# Altium schematic sheet LOGIC_FPGA.SchDoc: FPGA Logic
size B; Author: Michael Jones; Engineer: Michael Jones; Organization: Group VIII Technology; Address1: 1652 W 820 N; Address2: Provo; Address3: UT  84601; Address4: 801-379-0118; DocumentNumber: 3; Revision: A3; SheetNumber: 2; SheetTotal: 7
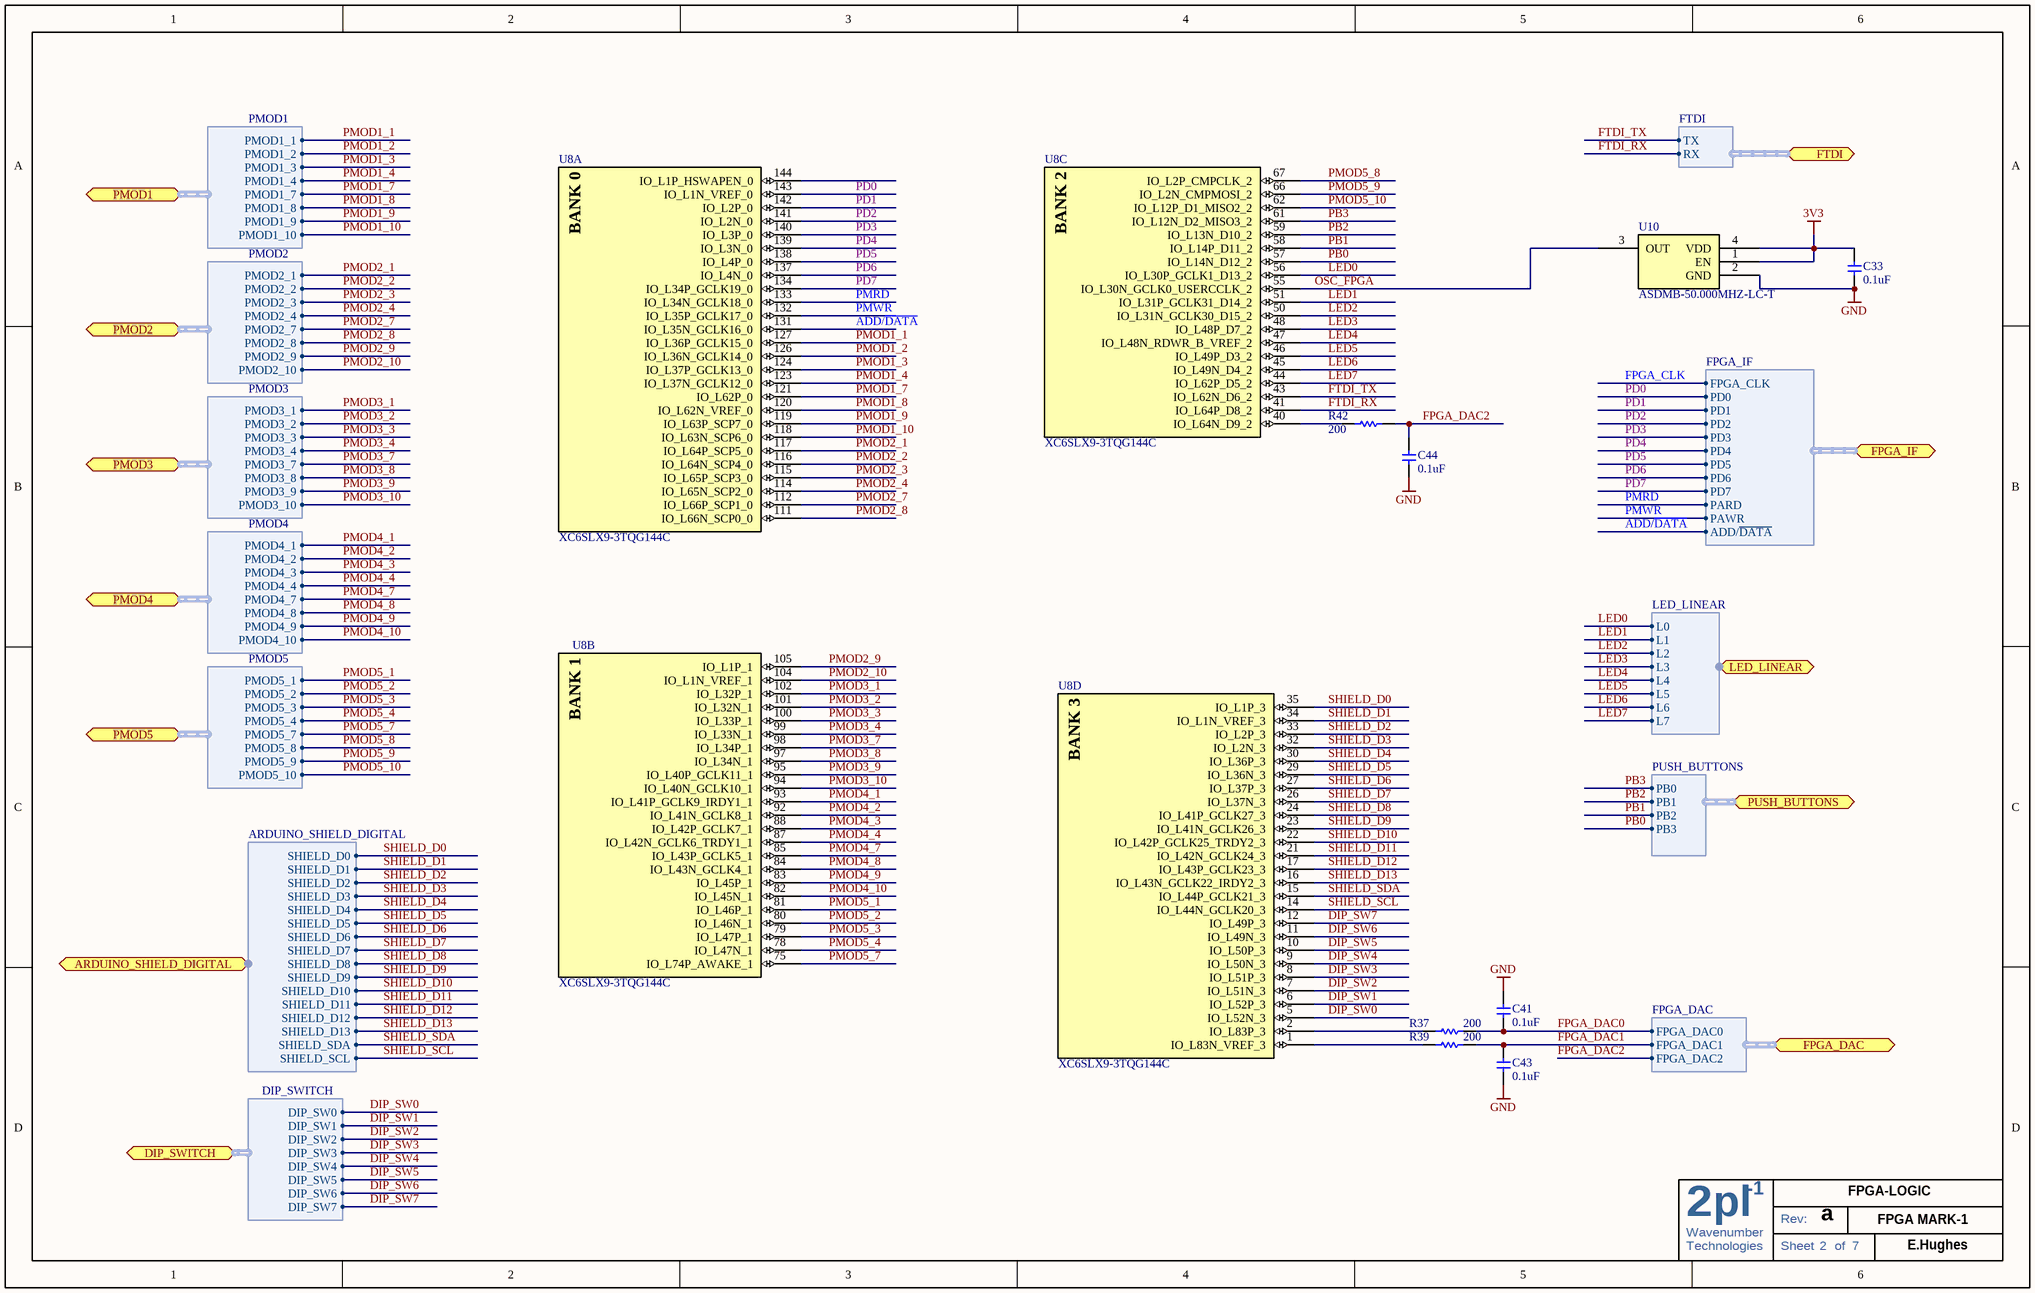
[diagram p0: LOGIC_FPGA.SchDoc]

## Parts
C33  0.1uF  [C0603]
C41  0.1uF  [C0603]
C43  0.1uF  [C0603]
C44  0.1uF  [C0603]
R37  200  [R0603]
R39  200  [R0603]
R42  200  [R0603]
U8  XC6SLX9-3TQG144C  [TQ144_L]  (parts A,B,C,D of 7)
U10  ASDMB-50.000MHZ-LC-T  [ASDMB - osc]

## Ports
ARDUINO_SHIELD_DIGITAL (harness ARDUINO_SHIELD_DIGITAL), DIP_SWITCH (harness DIP_SWITCH), FPGA_DAC (harness FPGA_DAC), FPGA_IF (harness FPGA_IF), FTDI (harness FTDI), LED_LINEAR (harness LED_LINEAR), PMOD1 (harness PMOD1), PMOD2 (harness PMOD2), PMOD3 (harness PMOD3), PMOD4 (harness PMOD4), PMOD5 (harness PMOD5), PUSH_BUTTONS (harness PUSH_BUTTONS)

## Harnesses
DIP_SWITCH: DIP_SW0, DIP_SW1, DIP_SW2, DIP_SW3, DIP_SW4, DIP_SW5, DIP_SW6, DIP_SW7
ARDUINO_SHIELD_DIGITAL: SHIELD_D13, SHIELD_D12, SHIELD_D11, SHIELD_D10, SHIELD_D9, SHIELD_D8, SHIELD_D7, SHIELD_D6, SHIELD_D5, SHIELD_D4, SHIELD_D3, SHIELD_D2, SHIELD_D1, SHIELD_D0, SHIELD_SDA, SHIELD_SCL
PUSH_BUTTONS: PB0, PB1, PB2, PB3
LED_LINEAR: L0, L1, L2, L3, L4, L5, L6, L7
FPGA_IF: PD0, PD1, PD2, PD3, PD4, PD5, PD6, PD7, PARD, PAWR, ADD/~{DATA}, FPGA_CLK
PMOD1: PMOD1_1, PMOD1_2, PMOD1_3, PMOD1_4, PMOD1_7, PMOD1_8, PMOD1_9, PMOD1_10
PMOD2: PMOD2_1, PMOD2_2, PMOD2_3, PMOD2_4, PMOD2_7, PMOD2_8, PMOD2_9, PMOD2_10
PMOD3: PMOD3_1, PMOD3_2, PMOD3_3, PMOD3_4, PMOD3_7, PMOD3_8, PMOD3_9, PMOD3_10
PMOD4: PMOD4_1, PMOD4_2, PMOD4_3, PMOD4_4, PMOD4_7, PMOD4_8, PMOD4_9, PMOD4_10
PMOD5: PMOD5_1, PMOD5_2, PMOD5_3, PMOD5_4, PMOD5_7, PMOD5_8, PMOD5_9, PMOD5_10
FTDI: TX, RX
FPGA_DAC: FPGA_DAC0, FPGA_DAC1, FPGA_DAC2

## Nets
3V3: C33.2 U10.1(EN) U10.4(VDD)
GND: C33.1 C41.2 C43.2 C44.2 U10.2(GND)
ADD/~{DATA}: U8.131(IO_L35N_GCLK16_0) ; port FPGA_IF.ADD/~{DATA}
DIP_SW0: U8.5(IO_L52N_3) ; port DIP_SWITCH.DIP_SW0
DIP_SW1: U8.6(IO_L52P_3) ; port DIP_SWITCH.DIP_SW1
DIP_SW2: U8.7(IO_L51N_3) ; port DIP_SWITCH.DIP_SW2
DIP_SW3: U8.8(IO_L51P_3) ; port DIP_SWITCH.DIP_SW3
DIP_SW4: U8.9(IO_L50N_3) ; port DIP_SWITCH.DIP_SW4
DIP_SW5: U8.10(IO_L50P_3) ; port DIP_SWITCH.DIP_SW5
DIP_SW6: U8.11(IO_L49N_3) ; port DIP_SWITCH.DIP_SW6
DIP_SW7: U8.12(IO_L49P_3) ; port DIP_SWITCH.DIP_SW7
FPGA_CLK: port FPGA_IF.FPGA_CLK
FPGA_DAC0: C41.1 R37.1 ; port FPGA_DAC.FPGA_DAC0
FPGA_DAC1: C43.1 R39.1 ; port FPGA_DAC.FPGA_DAC1
FPGA_DAC2: C44.1 R42.1 ; port FPGA_DAC.FPGA_DAC2
FTDI_RX: U8.41(IO_L64P_D8_2) ; port FTDI.RX
FTDI_TX: U8.43(IO_L62N_D6_2) ; port FTDI.TX
LED0: U8.56(IO_L30P_GCLK1_D13_2) ; port LED_LINEAR.L0
LED1: U8.51(IO_L31P_GCLK31_D14_2) ; port LED_LINEAR.L1
LED2: U8.50(IO_L31N_GCLK30_D15_2) ; port LED_LINEAR.L2
LED3: U8.48(IO_L48P_D7_2) ; port LED_LINEAR.L3
LED4: U8.47(IO_L48N_RDWR_B_VREF_2) ; port LED_LINEAR.L4
LED5: U8.46(IO_L49P_D3_2) ; port LED_LINEAR.L5
LED6: U8.45(IO_L49N_D4_2) ; port LED_LINEAR.L6
LED7: U8.44(IO_L62P_D5_2) ; port LED_LINEAR.L7
OSC_FPGA: U8.55(IO_L30N_GCLK0_USERCCLK_2) U10.3(OUT)
PB0: U8.57(IO_L14N_D12_2) ; port PUSH_BUTTONS.PB3
PB1: U8.58(IO_L14P_D11_2) ; port PUSH_BUTTONS.PB2
PB2: U8.59(IO_L13N_D10_2) ; port PUSH_BUTTONS.PB1
PB3: U8.61(IO_L12N_D2_MISO3_2) ; port PUSH_BUTTONS.PB0
PD0: U8.143(IO_L1N_VREF_0) ; port FPGA_IF.PD0
PD1: U8.142(IO_L2P_0) ; port FPGA_IF.PD1
PD2: U8.141(IO_L2N_0) ; port FPGA_IF.PD2
PD3: U8.140(IO_L3P_0) ; port FPGA_IF.PD3
PD4: U8.139(IO_L3N_0) ; port FPGA_IF.PD4
PD5: U8.138(IO_L4P_0) ; port FPGA_IF.PD5
PD6: U8.137(IO_L4N_0) ; port FPGA_IF.PD6
PD7: U8.134(IO_L34P_GCLK19_0) ; port FPGA_IF.PD7
PMOD1_1: U8.127(IO_L36P_GCLK15_0) ; port PMOD1.PMOD1_1
PMOD1_2: U8.126(IO_L36N_GCLK14_0) ; port PMOD1.PMOD1_2
PMOD1_3: U8.124(IO_L37P_GCLK13_0) ; port PMOD1.PMOD1_3
PMOD1_4: U8.123(IO_L37N_GCLK12_0) ; port PMOD1.PMOD1_4
PMOD1_7: U8.121(IO_L62P_0) ; port PMOD1.PMOD1_7
PMOD1_8: U8.120(IO_L62N_VREF_0) ; port PMOD1.PMOD1_8
PMOD1_9: U8.119(IO_L63P_SCP7_0) ; port PMOD1.PMOD1_9
PMOD1_10: U8.118(IO_L63N_SCP6_0) ; port PMOD1.PMOD1_10
PMOD2_1: U8.117(IO_L64P_SCP5_0) ; port PMOD2.PMOD2_1
PMOD2_2: U8.116(IO_L64N_SCP4_0) ; port PMOD2.PMOD2_2
PMOD2_3: U8.115(IO_L65P_SCP3_0) ; port PMOD2.PMOD2_3
PMOD2_4: U8.114(IO_L65N_SCP2_0) ; port PMOD2.PMOD2_4
PMOD2_7: U8.112(IO_L66P_SCP1_0) ; port PMOD2.PMOD2_7
PMOD2_8: U8.111(IO_L66N_SCP0_0) ; port PMOD2.PMOD2_8
PMOD2_9: U8.105(IO_L1P_1) ; port PMOD2.PMOD2_9
PMOD2_10: U8.104(IO_L1N_VREF_1) ; port PMOD2.PMOD2_10
PMOD3_1: U8.102(IO_L32P_1) ; port PMOD3.PMOD3_1
PMOD3_2: U8.101(IO_L32N_1) ; port PMOD3.PMOD3_2
PMOD3_3: U8.100(IO_L33P_1) ; port PMOD3.PMOD3_3
PMOD3_4: U8.99(IO_L33N_1) ; port PMOD3.PMOD3_4
PMOD3_7: U8.98(IO_L34P_1) ; port PMOD3.PMOD3_7
PMOD3_8: U8.97(IO_L34N_1) ; port PMOD3.PMOD3_8
PMOD3_9: U8.95(IO_L40P_GCLK11_1) ; port PMOD3.PMOD3_9
PMOD3_10: U8.94(IO_L40N_GCLK10_1) ; port PMOD3.PMOD3_10
PMOD4_1: U8.93(IO_L41P_GCLK9_IRDY1_1) ; port PMOD4.PMOD4_1
PMOD4_2: U8.92(IO_L41N_GCLK8_1) ; port PMOD4.PMOD4_2
PMOD4_3: U8.88(IO_L42P_GCLK7_1) ; port PMOD4.PMOD4_3
PMOD4_4: U8.87(IO_L42N_GCLK6_TRDY1_1) ; port PMOD4.PMOD4_4
PMOD4_7: U8.85(IO_L43P_GCLK5_1) ; port PMOD4.PMOD4_7
PMOD4_8: U8.84(IO_L43N_GCLK4_1) ; port PMOD4.PMOD4_8
PMOD4_9: U8.83(IO_L45P_1) ; port PMOD4.PMOD4_9
PMOD4_10: U8.82(IO_L45N_1) ; port PMOD4.PMOD4_10
PMOD5_1: U8.81(IO_L46P_1) ; port PMOD5.PMOD5_1
PMOD5_2: U8.80(IO_L46N_1) ; port PMOD5.PMOD5_2
PMOD5_3: U8.79(IO_L47P_1) ; port PMOD5.PMOD5_3
PMOD5_4: U8.78(IO_L47N_1) ; port PMOD5.PMOD5_4
PMOD5_7: U8.75(IO_L74P_AWAKE_1) ; port PMOD5.PMOD5_7
PMOD5_8: U8.67(IO_L2P_CMPCLK_2) ; port PMOD5.PMOD5_8
PMOD5_9: U8.66(IO_L2N_CMPMOSI_2) ; port PMOD5.PMOD5_9
PMOD5_10: U8.62(IO_L12P_D1_MISO2_2) ; port PMOD5.PMOD5_10
PMRD: U8.133(IO_L34N_GCLK18_0) ; port FPGA_IF.PARD
PMWR: U8.132(IO_L35P_GCLK17_0) ; port FPGA_IF.PAWR
SHIELD_D0: U8.35(IO_L1P_3) ; port ARDUINO_SHIELD_DIGITAL.SHIELD_D0
SHIELD_D1: U8.34(IO_L1N_VREF_3) ; port ARDUINO_SHIELD_DIGITAL.SHIELD_D1
SHIELD_D2: U8.33(IO_L2P_3) ; port ARDUINO_SHIELD_DIGITAL.SHIELD_D2
SHIELD_D3: U8.32(IO_L2N_3) ; port ARDUINO_SHIELD_DIGITAL.SHIELD_D3
SHIELD_D4: U8.30(IO_L36P_3) ; port ARDUINO_SHIELD_DIGITAL.SHIELD_D4
SHIELD_D5: U8.29(IO_L36N_3) ; port ARDUINO_SHIELD_DIGITAL.SHIELD_D5
SHIELD_D6: U8.27(IO_L37P_3) ; port ARDUINO_SHIELD_DIGITAL.SHIELD_D6
SHIELD_D7: U8.26(IO_L37N_3) ; port ARDUINO_SHIELD_DIGITAL.SHIELD_D7
SHIELD_D8: U8.24(IO_L41P_GCLK27_3) ; port ARDUINO_SHIELD_DIGITAL.SHIELD_D8
SHIELD_D9: U8.23(IO_L41N_GCLK26_3) ; port ARDUINO_SHIELD_DIGITAL.SHIELD_D9
SHIELD_D10: U8.22(IO_L42P_GCLK25_TRDY2_3) ; port ARDUINO_SHIELD_DIGITAL.SHIELD_D10
SHIELD_D11: U8.21(IO_L42N_GCLK24_3) ; port ARDUINO_SHIELD_DIGITAL.SHIELD_D11
SHIELD_D12: U8.17(IO_L43P_GCLK23_3) ; port ARDUINO_SHIELD_DIGITAL.SHIELD_D12
SHIELD_D13: U8.16(IO_L43N_GCLK22_IRDY2_3) ; port ARDUINO_SHIELD_DIGITAL.SHIELD_D13
SHIELD_SCL: U8.14(IO_L44N_GCLK20_3) ; port ARDUINO_SHIELD_DIGITAL.SHIELD_SCL
SHIELD_SDA: U8.15(IO_L44P_GCLK21_3) ; port ARDUINO_SHIELD_DIGITAL.SHIELD_SDA
NetR37_2: R37.2 U8.2(IO_L83P_3)
NetR39_2: R39.2 U8.1(IO_L83N_VREF_3)
NetR42_2: R42.2 U8.40(IO_L64N_D9_2)

Not connected (* = marked no-connect by the designer): U8 144(IO_L1P_HSWAPEN_0)

## Notes on the sheet
- a
- FPGA-LOGIC
- FPGA MARK-1
- E.Hughes
- 2
- Wavenumber
- pl
- -1
- Rev:
- Technologies
- Sheet
- of
- (in symbol XC6SLX9-3TQG144C, part A) BANK 0
- (in symbol XC6SLX9-3TQG144C, part B) BANK 1
- (in symbol XC6SLX9-3TQG144C, part C) BANK 2
- (in symbol XC6SLX9-3TQG144C, part D) BANK 3

## Library data of the parts
C33 C41 C43 C44 = GRM188R71H104KA93D: CAP CER .1UF 50V 10% X7R 0603; Manufacturer: Murata Electronics North America; Capacitance: 0.1µF; Manufacturer Part Number: GRM188R71H104KA93D; Supplier 1: Digi-Key; Supplier Part Number 1: 490-1519-1-ND; RoHS: RoHS Compliant; Category: Capacitors; Pricing 1: 10=0.037, 100=0.0221, 500=0.01276, 1000=0.00884 (USD); Voltage - Rated: 50V; Tolerance: ±10%; Temperature Coefficient: X7R; Mounting Type: Surface Mount, MLCC; Operating Temperature: -55°C ~ 125°C; Features: -; Applications: General Purpose; Ratings: -; Package / Case: 0603 (1608 Metric); Size / Dimension: 0.063" L x 0.031" W (1.60mm x 0.80mm); Lead Spacing: -; Thickness: 0.80mm; Packaging: Cut Tape (CT); Lead Style: -; ComponentLink1URL: http://search.murata.co.jp/Ceramy/image/img/PDF/ENG/GRM188R71H104KA93.pdf; ComponentLink1Description: http://search.murata.co.jp/Ceramy/image/img/PDF/ENG/GRM188R71H104KA93.pdf
  C33: Value: CAP CER .1UF 50V 10% X7R 0603; Stock 1: 9370695
  C41 C43 C44: Value: 0.1uF; Stock 1: 6315460
R37 R39 R42 = ERJ-3EKF2000V: RES 200 OHM 1/10W 1% 0603 SMD; Manufacturer: Panasonic - ECG; Power (Watts): 0.1W, 1/10W; Temperature Coefficient: ±100ppm/°C; Value: RES 200 OHM 1/10W 1% 0603 SMD; Supplier 1: Digi-Key; Supplier Part Number 1: P200HCT-ND; Manufacturer Part Number: ERJ-3EKF2000V; RoHS: RoHS Compliant; Category: Resistors; Stock 1: 1279595; Pricing 1: 1=0.04, 50=0.015, 100=0.0114, 250=0.00844, 500=0.00624, 1000=0.00416 (USD); Resistance (Ohms): 200; Composition: Thick Film; Features: -; Tolerance: ±1%; Size / Dimension: 0.063" L x 0.031" W (1.60mm x 0.80mm); Height: 0.018" (0.45mm); Lead Style: Surface Mount (SMD - SMT); Packaging: Cut Tape (CT); Package / Case: 0603 (1608 Metric); ComponentLink1URL: http://industrial.panasonic.com/www-cgi/jvcr13pz.cgi?E+PZ+3+AOA0002+ERJ3EKF2000V+7+WW; ComponentLink1Description: http://industrial.panasonic.com/www-cgi/jvcr13pz.cgi?E+PZ+3+AOA0002+ERJ3EKF2000V+7+WW
U8 = XC6SLX9-3TQG144C: IC FPAG SPARTAN 6 9K 144TQFP; Manufacturer: Xilinx Inc; Number of Logic Elements/Cells: 9152; Number of LABs/CLBs: 715; Total RAM Bits: 589824; Number of I /O: 102; Voltage - Supply: 1.14 V ~ 1.26 V; Supplier 1: Digi-Key; Supplier Part Number 1: 122-1747-ND; Manufacturer Part Number: XC6SLX9-3TQG144C; RoHS: RoHS Compliant; Category: Integrated Circuits (ICs); Stock 1: 77; Pricing 1: 1=17.22 (USD); Number of Gates: -; Mounting Type: Surface Mount; Operating Temperature: 0°C ~ 85°C; Package / Case: 144-LQFP; Supplier Device Package: 144-TQFP (20x20); ComponentLink1URL: http://www.xilinx.com/support/documentation/data_sheets/ds160.pdf; ComponentLink1Description: http://www.xilinx.com/support/documentation/data_sheets/ds160.pdf; Value: XC6SLX9-3TQG144C
U10 = ASDMB-50.000MHZ-LC-T: OSC MEMS 50.000 MHZ SMD; Manufacturer: Abracon Corporation; Frequency: 50MHz; Function: Tri-State (Output Enable); Output: CMOS; Voltage - Supply: 1.8 V ~ 3.3 V; Frequency Stability: ±50ppm; Current - Supply (Max): 16mA; Current - Supply (Disable) (Max): 15µA; Supplier 1: Digi-Key; Manufacturer Part Number: ASDMB-50.000MHZ-LC-T; RoHS: RoHS Compliant; Category: Crystals and Oscillators; Stock 1: 967; Pricing 1: 1=1.69, 10=1.463, 50=1.2826, 100=1.0125, 500=0.855 (USD); Type: MEMS (Silicon); Operating Temperature: -40°C ~ 85°C; Mounting Type: Surface Mount; Size / Dimension: 0.098" L x 0.079" W (2.50mm x 2.00mm); Height: 0.035" (0.90mm); Package / Case: 4-SMD, No Lead (DFN, LCC); Packaging: Cut Tape (CT); ComponentLink1URL: http://www.abracon.com/Oscillators/ASDMB.pdf; ComponentLink1Description: http://www.abracon.com/Oscillators/ASDMB.pdf; Supplier Part Number 1: 535-11738-1-ND; Value: ASDMB-50.000MHZ-LC-T